# Altium project LPCB223__RLOOP__POWER_NODE.PrjPCB
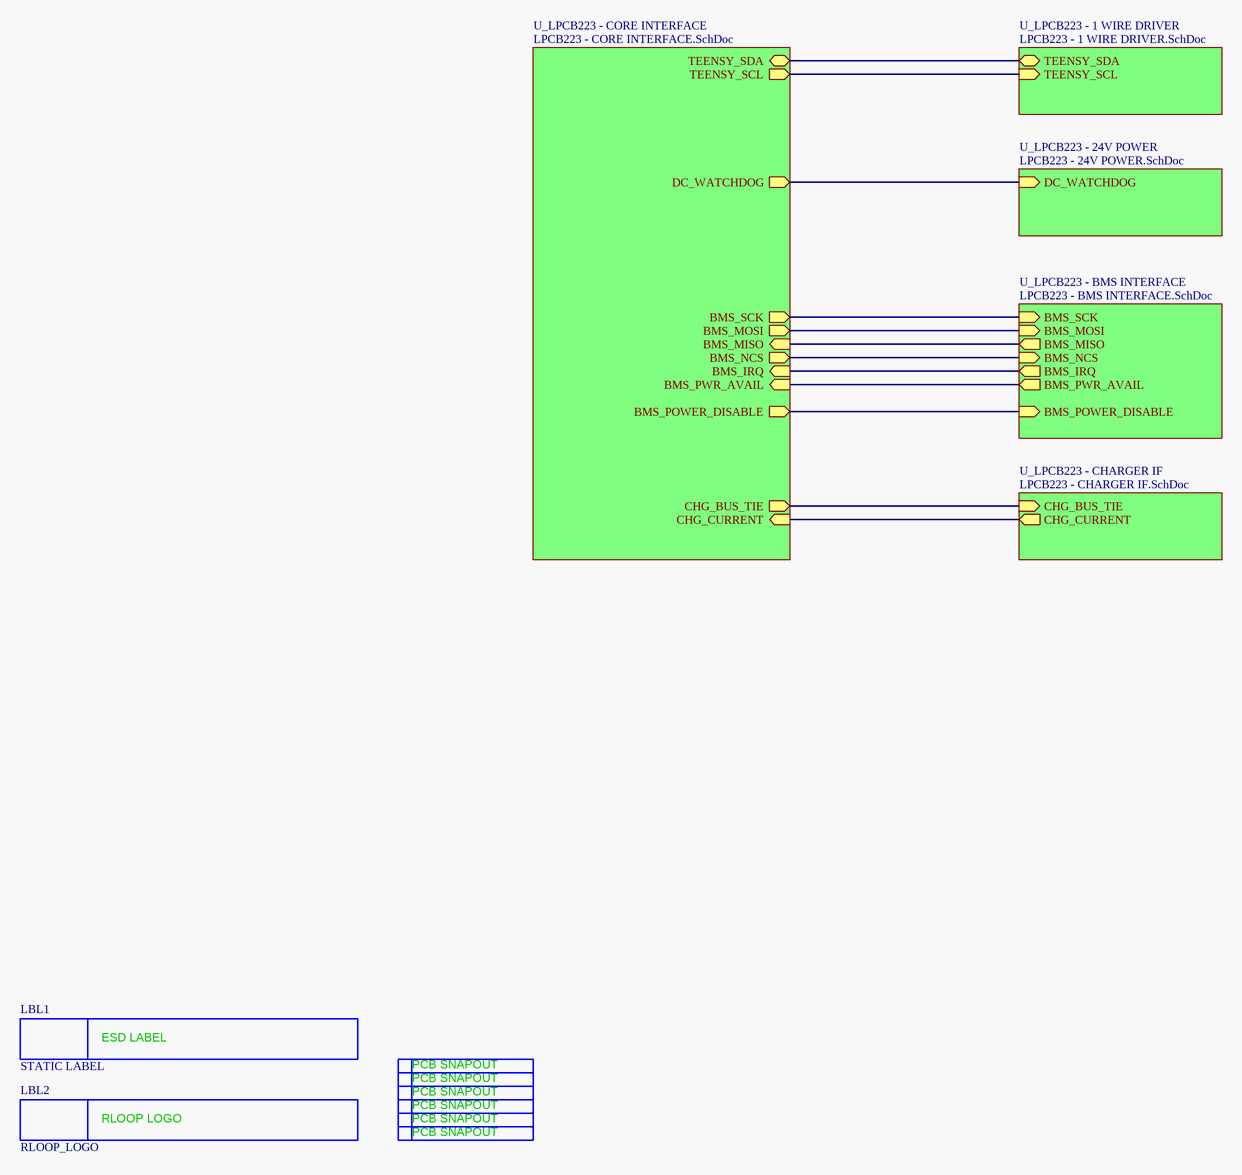
[diagram p0: LPCB223 - OVERVIEW.SchDoc]
6 sheets, 52 parts. Net scope: hierarchical (ports join the sheet entries above them; power ports are global).
Board files: LPCB223R0.PcbDoc, LPCB223R0__ASCII.PcbDoc
Sheets:
  LPCB223 - OVERVIEW.SchDoc
    U_LPCB223 - CORE INTERFACE = LPCB223 - CORE INTERFACE.SchDoc
    U_LPCB223 - 1 WIRE DRIVER = LPCB223 - 1 WIRE DRIVER.SchDoc
    U_LPCB223 - 24V POWER = LPCB223 - 24V POWER.SchDoc
    U_LPCB223 - BMS INTERFACE = LPCB223 - BMS INTERFACE.SchDoc
    U_LPCB223 - CHARGER IF = LPCB223 - CHARGER IF.SchDoc

## Sheet LPCB223 - OVERVIEW.SchDoc
size A3; Address1: Factory 10; Address2: 9-13 Dingley Avenue, Dandeong, VICTORIA 3175, AUSTRALIA; DocumentNumber: 1; Revision: 1; SheetNumber: 1; SheetTotal: 6; Lockie__PCB_SUB_ASSEMBLY: Overview; Lockie__PCB_ASSEMBLY: Main; Lockie__LDL: LPCB223; Lockie__PCB_DESCRIPTION: Power Node

### Parts
LBL1  STATIC LABEL  [STATIC_LABEL]  (no BOM)
LBL2  RLOOP_LOGO  [RLOOP_LOGO]  (no BOM)
SN1  PCB_SNAPOUT  [SNAPOUT_NEW]  (value not drawn)  (no BOM)
SN2  PCB_SNAPOUT  [SNAPOUT_NEW]  (value not drawn)  (no BOM)
SN3  PCB_SNAPOUT  [SNAPOUT_NEW]  (value not drawn)  (no BOM)
SN4  PCB_SNAPOUT  [SNAPOUT_NEW]  (value not drawn)  (no BOM)
SN5  PCB_SNAPOUT  [SNAPOUT_NEW]  (value not drawn)  (no BOM)
SN6  PCB_SNAPOUT  [SNAPOUT_NEW]  (value not drawn)  (no BOM)

### Sub-sheets
U_LPCB223 - 1 WIRE DRIVER = LPCB223 - 1 WIRE DRIVER.SchDoc: TEENSY_SDA (bidir), TEENSY_SCL (in)
U_LPCB223 - 24V POWER = LPCB223 - 24V POWER.SchDoc: DC_WATCHDOG (in)
U_LPCB223 - BMS INTERFACE = LPCB223 - BMS INTERFACE.SchDoc: BMS_MOSI (in), BMS_SCK (in), BMS_MISO (out), BMS_PWR_AVAIL (out), BMS_NCS (in), BMS_IRQ (out), BMS_POWER_DISABLE (in)
U_LPCB223 - CHARGER IF = LPCB223 - CHARGER IF.SchDoc: CHG_BUS_TIE (in), CHG_CURRENT (out)
U_LPCB223 - CORE INTERFACE = LPCB223 - CORE INTERFACE.SchDoc: BMS_MOSI (out), BMS_SCK (out), BMS_MISO (in), BMS_PWR_AVAIL (in), BMS_NCS (out), BMS_IRQ (in), DC_WATCHDOG (out), CHG_CURRENT (in), TEENSY_SDA (bidir), TEENSY_SCL (out), BMS_POWER_DISABLE (out), CHG_BUS_TIE (out)

### Nets
NetC8_1: sheet U_LPCB223 - CORE INTERFACE/CHG_CURRENT, sheet U_LPCB223 - CHARGER IF/CHG_CURRENT
NetCN1_2: sheet U_LPCB223 - CORE INTERFACE/DC_WATCHDOG, sheet U_LPCB223 - 24V POWER/DC_WATCHDOG
NetCN2_13: sheet U_LPCB223 - CORE INTERFACE/BMS_POWER_DISABLE, sheet U_LPCB223 - BMS INTERFACE/BMS_POWER_DISABLE
NetCN7_SCL: sheet U_LPCB223 - CORE INTERFACE/TEENSY_SCL, sheet U_LPCB223 - 1 WIRE DRIVER/TEENSY_SCL
NetCN7_SDA: sheet U_LPCB223 - CORE INTERFACE/TEENSY_SDA, sheet U_LPCB223 - 1 WIRE DRIVER/TEENSY_SDA
NetCN7_T10: sheet U_LPCB223 - CORE INTERFACE/BMS_NCS, sheet U_LPCB223 - BMS INTERFACE/BMS_NCS
NetCN7_T11: sheet U_LPCB223 - CORE INTERFACE/BMS_MOSI, sheet U_LPCB223 - BMS INTERFACE/BMS_MOSI
NetCN7_T12: sheet U_LPCB223 - CORE INTERFACE/BMS_MISO, sheet U_LPCB223 - BMS INTERFACE/BMS_MISO
NetCN7_T13: sheet U_LPCB223 - CORE INTERFACE/BMS_SCK, sheet U_LPCB223 - BMS INTERFACE/BMS_SCK
NetCN7_T15: sheet U_LPCB223 - CORE INTERFACE/CHG_BUS_TIE, sheet U_LPCB223 - CHARGER IF/CHG_BUS_TIE
NetCN7_T32: sheet U_LPCB223 - CORE INTERFACE/BMS_PWR_AVAIL, sheet U_LPCB223 - BMS INTERFACE/BMS_PWR_AVAIL
NetCN7_T33: sheet U_LPCB223 - CORE INTERFACE/BMS_IRQ, sheet U_LPCB223 - BMS INTERFACE/BMS_IRQ

### Notes on the sheet
- PCB COMPONENT DESCRIPTION
- LDL NUMBER
- Assembly Details
- Size
- Drawing File Name
- Revision
- http://rloop.org
- Scale
- A3
- Sheet Details
- N.T.S
- Sheet:
- Of:
- (in symbol PCB_SNAPOUT) PCB SNAPOUT
- (in symbol RLOOP_LOGO) RLOOP LOGO
- (in symbol STATIC LABEL) ESD LABEL

### Library data of the parts
LBL1 = STATIC LABEL: FMEDA__CHANNEL: DIAG; FMEDA__FUNCTION_IN_SYSTEM: *
LBL2 = RLOOP_LOGO: FMEDA__CHANNEL: DIAG; FMEDA__FUNCTION_IN_SYSTEM: *
SN1-SN6 = PCB_SNAPOUT: FMEDA__CHANNEL: DIAG; FMEDA__FUNCTION_IN_SYSTEM: *

## Sheet LPCB223 - CORE INTERFACE.SchDoc
size A3; Address1: Factory 10; Address2: 9-13 Dingley Avenue, Dandeong, VICTORIA 3175, AUSTRALIA; DocumentNumber: 6; Revision: 1; SheetNumber: 6; SheetTotal: 6; Lockie__PCB_SUB_ASSEMBLY: Core Interface; Lockie__PCB_ASSEMBLY: Main; Lockie__LDL: LPCB223; Lockie__PCB_DESCRIPTION: Power Node
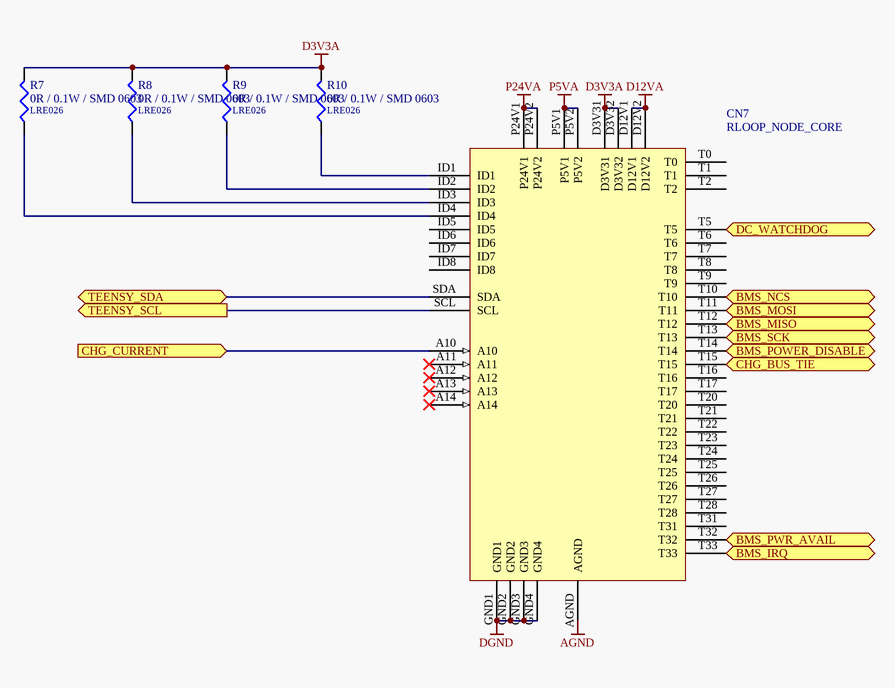
[diagram p1: LPCB223 - CORE INTERFACE.SchDoc]

### Parts
CN7  RLOOP_NODE_CORE  [RLOOP_NODE_CORE]  (no BOM)
R7  0R / 0.1W / SMD 0603  LDL_NUMBER: LRE026  [LFP020__CR1608-0603-IPC7351_B]
R8  0R / 0.1W / SMD 0603  LDL_NUMBER: LRE026  [LFP020__CR1608-0603-IPC7351_B]
R9  0R / 0.1W / SMD 0603  LDL_NUMBER: LRE026  [LFP020__CR1608-0603-IPC7351_B]
R10  0R / 0.1W / SMD 0603  LDL_NUMBER: LRE026  [LFP020__CR1608-0603-IPC7351_B]

### Ports
BMS_IRQ (in), BMS_MISO (in), BMS_MOSI (out), BMS_NCS (out), BMS_POWER_DISABLE (out), BMS_PWR_AVAIL (in), BMS_SCK (out), CHG_BUS_TIE (out), CHG_CURRENT (in), DC_WATCHDOG (out), TEENSY_SCL (out), TEENSY_SDA (bidir)

### Nets
AGND: CN7.AGND
D3V3A: CN7.D3V31 CN7.D3V32 R7.2 R8.2 R9.2 R10.2
D12VA: CN7.D12V1 CN7.D12V2
DGND: CN7.GND1 CN7.GND2 CN7.GND3 CN7.GND4
P5VA: CN7.P5V1 CN7.P5V2
P24VA: CN7.P24V1 CN7.P24V2
NetC8_1: CN7.A10 ; port CHG_CURRENT
NetCN1_2: CN7.T5 ; port DC_WATCHDOG
NetCN2_13: CN7.T14 ; port BMS_POWER_DISABLE
NetCN7_ID1: CN7.ID1 R10.1
NetCN7_ID2: CN7.ID2 R9.1
NetCN7_ID3: CN7.ID3 R8.1
NetCN7_ID4: CN7.ID4 R7.1
NetCN7_SCL: CN7.SCL ; port TEENSY_SCL
NetCN7_SDA: CN7.SDA ; port TEENSY_SDA
NetCN7_T10: CN7.T10 ; port BMS_NCS
NetCN7_T11: CN7.T11 ; port BMS_MOSI
NetCN7_T12: CN7.T12 ; port BMS_MISO
NetCN7_T13: CN7.T13 ; port BMS_SCK
NetCN7_T15: CN7.T15 ; port CHG_BUS_TIE
NetCN7_T32: CN7.T32 ; port BMS_PWR_AVAIL
NetCN7_T33: CN7.T33 ; port BMS_IRQ

Not connected (* = marked no-connect by the designer): CN7 A11* A12* A13* A14* ID5 ID6 ID7 ID8 T0 T1 T2 T6 T7 T8 T9 T16 T17 T20 T21 T22 T23 T24 T25 T26 T27 T28 T31

### Notes on the sheet
- PCB COMPONENT DESCRIPTION
- LDL NUMBER
- Assembly Details
- Size
- Drawing File Name
- Revision
- http://rloop.org
- Scale
- A3
- Sheet Details
- N.T.S
- Sheet:
- Of:

### Library data of the parts
CN7 = RLOOP_NODE_CORE: rLoop Node Core Connector; FMEDA__CHANNEL: COM; FMEDA__OPERATING__CURRENT_MAX: 0; FMEDA__OPERATING__TEMP_MAX: 50; FMEDA__OPERATING__TEMP_MIN: -20; FMEDA__OPERATING__TEMP_TYP: 27; FMEDA__OPERATING__VOLTAGE_MAX: 16; FMEDA__OPERATING__VOLTAGE_TYP: 12; FMEDA__OPERATING__CURRENT_MIN: 0; FMEDA__OPERATING__CURRENT_TYP: 0; FMEDA__OPERATING__VOLTAGE_MIN: 0
R7-R10 = 0R / 0.1W / SMD 0603: Resistor, Ceramic Chip, 0R, 0.1W, SMD 0603 [LRE026]; Value: 0; FMEDA__OPERATING__TEMP_MAX: 50; FMEDA__OPERATING__TEMP_MIN: -20; FMEDA__OPERATING__TEMP_TYP: 27; FMEDA__CHANNEL: COM; FMEDA__OPERATING__POWER_MAX: 0; FMEDA__OPERATING__POWER_MIN: 0; FMEDA__OPERATING__VOLTAGE_MAX: 0; FMEDA__OPERATING__VOLTAGE_MIN: 0; FMEDA__OPERATING__VOLTAGE_TYP: 0; FMEDA__FUNCTION_IN_SYSTEM: *

## Sheet LPCB223 - 1 WIRE DRIVER.SchDoc
size A3; Address1: Factory 10; Address2: 9-13 Dingley Avenue, Dandeong, VICTORIA 3175, AUSTRALIA; DocumentNumber: 2; Revision: 1; SheetNumber: 2; SheetTotal: 6; Lockie__PCB_SUB_ASSEMBLY: 1 Wire; Lockie__PCB_ASSEMBLY: Main; Lockie__LDL: LPCB223; Lockie__PCB_DESCRIPTION: Power Node
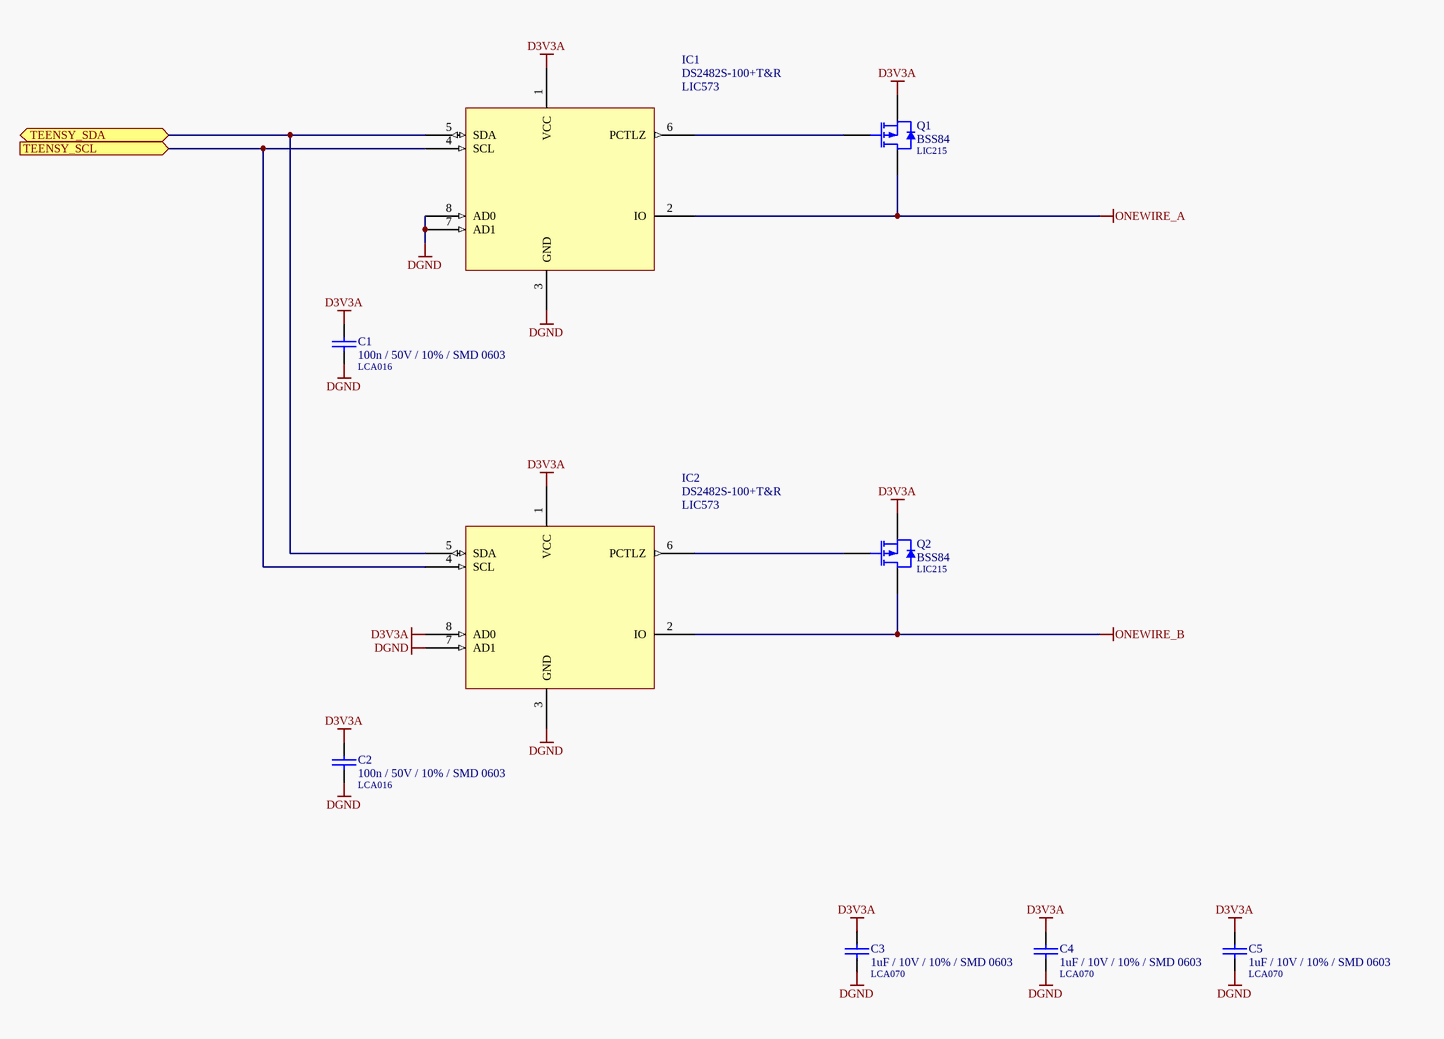
[diagram p2: LPCB223 - 1 WIRE DRIVER.SchDoc]

### Parts
C1  100n / 50V / 10% / SMD 0603  LDL_NUMBER: LCA016  [LFP011__CC1608-0603-IPC7351_B]
C2  100n / 50V / 10% / SMD 0603  LDL_NUMBER: LCA016  [LFP011__CC1608-0603-IPC7351_B]
C3  1uF / 10V / 10% / SMD 0603  LDL_NUMBER: LCA070  [LFP011__CC1608-0603-IPC7351_B]
C4  1uF / 10V / 10% / SMD 0603  LDL_NUMBER: LCA070  [LFP011__CC1608-0603-IPC7351_B]
C5  1uF / 10V / 10% / SMD 0603  LDL_NUMBER: LCA070  [LFP011__CC1608-0603-IPC7351_B]
IC1  DS2482S-100+T&R  LDL_NUMBER: LIC573  [LFP069__R-8G]
IC2  DS2482S-100+T&R  LDL_NUMBER: LIC573  [LFP069__R-8G]
Q1  BSS84  LDL_NUMBER: LIC215  [LFP021__SOT23]
Q2  BSS84  LDL_NUMBER: LIC215  [LFP021__SOT23]

### Ports
TEENSY_SCL (in), TEENSY_SDA (bidir)

### Nets
D3V3A: C1.1 C2.1 C3.1 C4.1 C5.1 IC1.1(VCC) IC2.1(VCC) IC2.8(AD0) Q1.2(S) Q2.2(S)
DGND: C1.2 C2.2 C3.2 C4.2 C5.2 IC1.3(GND) IC1.7(AD1) IC1.8(AD0) IC2.3(GND) IC2.7(AD1)
ONEWIRE_A: IC1.2(IO) Q1.3(D)
ONEWIRE_B: IC2.2(IO) Q2.3(D)
NetCN7_SCL: IC1.4(SCL) IC2.4(SCL) ; port TEENSY_SCL
NetCN7_SDA: IC1.5(SDA) IC2.5(SDA) ; port TEENSY_SDA
NetIC1_6: IC1.6(PCTLZ) Q1.1(G)
NetIC2_6: IC2.6(PCTLZ) Q2.1(G)

### Notes on the sheet
- PCB COMPONENT DESCRIPTION
- LDL NUMBER
- Assembly Details
- Size
- Drawing File Name
- Revision
- http://rloop.org
- Scale
- A3
- Sheet Details
- N.T.S
- Sheet:
- Of:

### Library data of the parts
C1 C2 = 100n / 50V / 10% / SMD 0603: Capacitor, Ceramic Chip, 100nF (0.1uF), 50V, 5%, SMD 0603 [LCA016]; FMEDA__OPERATING__VOLTAGE_MIN: 0; FMEDA__OPERATING__VOLTAGE_MAX: 3.3; FMEDA__OPERATING__TEMP_MIN: -20; FMEDA__OPERATING__TEMP_TYP: 27; FMEDA__OPERATING__TEMP_MAX: 50; FMEDA__CHANNEL: COM; Value: 100n; FMEDA__FUNCTION_IN_SYSTEM: *; FMEDA__OPERATING__VOLTAGE_TYP: 3.3
C3-C5 = 1uF / 10V / 10% / SMD 0603: Capacitor, Ceramic Chip, 1uF, 10V, SMD 0603 [LCA070]; Value: 1u; FMEDA__OPERATING__VOLTAGE_MAX: 3.3; FMEDA__OPERATING__VOLTAGE_MIN: 0; FMEDA__OPERATING__TEMP_MAX: 50; FMEDA__OPERATING__TEMP_MIN: -20; FMEDA__OPERATING__TEMP_TYP: 27; FMEDA__CHANNEL: COM; FMEDA__OPERATING__VOLTAGE_TYP: 3.3; FMEDA__FUNCTION_IN_SYSTEM: *
IC1 IC2 = DS2482S-100+T&R: IC, I2C to 1 Wire Bridge, SMD SOIC8
Q1 Q2 = BSS84: FET, P Channel, Logic Level, SMD SOT23 [LIC215]; FMEDA__OPERATING__TEMP_MAX: 50; FMEDA__OPERATING__TEMP_MIN: -20; FMEDA__OPERATING__TEMP_TYP: 27; FMEDA__CHANNEL: COM

## Sheet LPCB223 - 24V POWER.SchDoc
size A3; Address1: Factory 10; Address2: 9-13 Dingley Avenue, Dandeong, VICTORIA 3175, AUSTRALIA; DocumentNumber: 3; Revision: 1; SheetNumber: 3; SheetTotal: 6; Lockie__PCB_SUB_ASSEMBLY: 24V Switch; Lockie__PCB_ASSEMBLY: Main; Lockie__LDL: LPCB223; Lockie__PCB_DESCRIPTION: Power Node
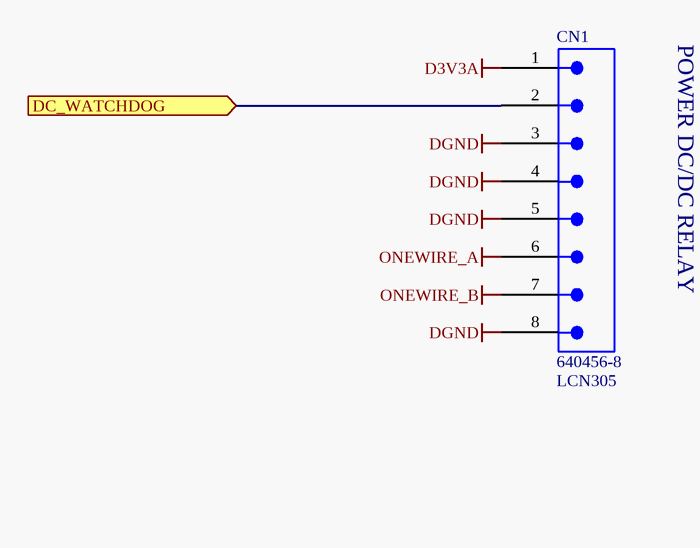
[diagram p3: LPCB223 - 24V POWER.SchDoc]

### Parts
CN1  640456-8  LDL_NUMBER: LCN305  [640456-8]

### Ports
DC_WATCHDOG (in)

### Nets
D3V3A: CN1.1
DGND: CN1.3 CN1.4 CN1.5 CN1.8
ONEWIRE_A: CN1.6
ONEWIRE_B: CN1.7
NetCN1_2: CN1.2 ; port DC_WATCHDOG

### Notes on the sheet
- POWER DC/DC RELAY
- PCB COMPONENT DESCRIPTION
- LDL NUMBER
- Assembly Details
- Size
- Drawing File Name
- Revision
- http://rloop.org
- Scale
- A3
- Sheet Details
- N.T.S
- Sheet:
- Of:

### Library data of the parts
CN1 = 640456-8: Connector, Male Header, 8 Way; FMEDA__CHANNEL: COM; FMEDA__OPERATING__CURRENT_MAX: 0; FMEDA__OPERATING__TEMP_MAX: 50; FMEDA__OPERATING__TEMP_MIN: -20; FMEDA__OPERATING__TEMP_TYP: 27; FMEDA__OPERATING__VOLTAGE_MAX: 16; FMEDA__OPERATING__VOLTAGE_TYP: 12; FMEDA__FUNCTION_IN_SYSTEM: *; FMEDA__OPERATING__CURRENT_MIN: 0; FMEDA__OPERATING__CURRENT_TYP: 0; FMEDA__OPERATING__VOLTAGE_MIN: 0

## Sheet LPCB223 - BMS INTERFACE.SchDoc
size A3; Address1: Factory 10; Address2: 9-13 Dingley Avenue, Dandeong, VICTORIA 3175, AUSTRALIA; DocumentNumber: 4; Revision: 1; SheetNumber: 4; SheetTotal: 6; Lockie__PCB_SUB_ASSEMBLY: BMS Interface; Lockie__PCB_ASSEMBLY: Main; Lockie__LDL: LPCB223; Lockie__PCB_DESCRIPTION: Power Node
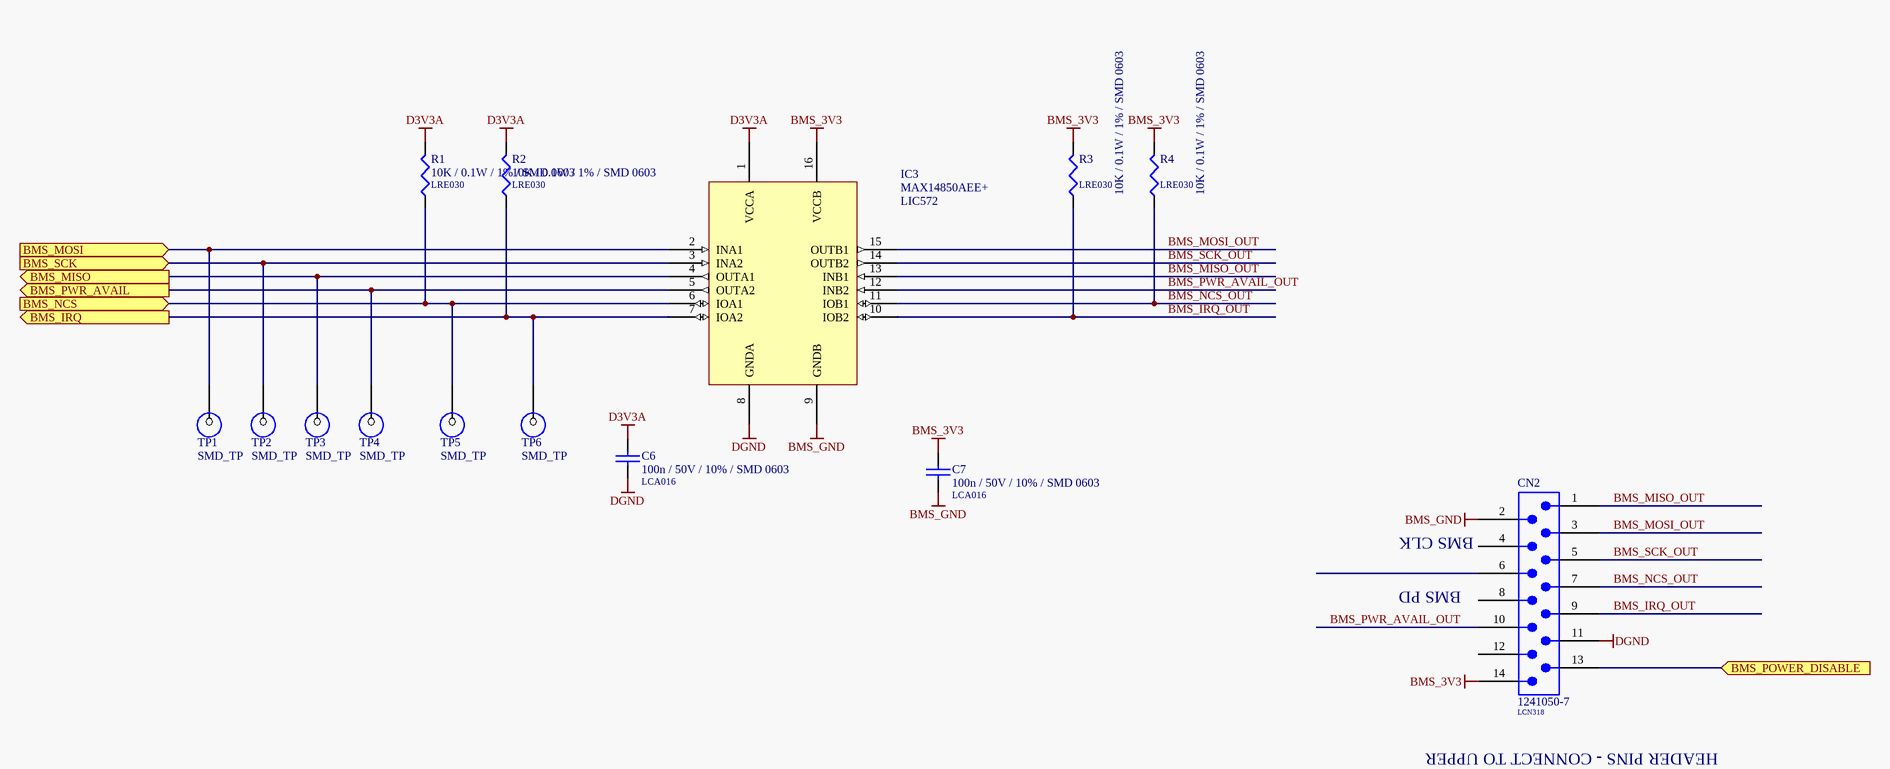
[diagram p4: LPCB223 - BMS INTERFACE.SchDoc]

### Parts
C6  100n / 50V / 10% / SMD 0603  LDL_NUMBER: LCA016  [LFP011__CC1608-0603-IPC7351_B]
C7  100n / 50V / 10% / SMD 0603  LDL_NUMBER: LCA016  [LFP011__CC1608-0603-IPC7351_B]
CN2  1241050-7  LDL_NUMBER: LCN318  [1241050-7]
IC3  MAX14850AEE+  LDL_NUMBER: LIC572  [LFP137__PW016]
R1  10K / 0.1W / 1% / SMD 0603  LDL_NUMBER: LRE030  [LFP020__CR1608-0603-IPC7351_B]
R2  10K / 0.1W / 1% / SMD 0603  LDL_NUMBER: LRE030  [LFP020__CR1608-0603-IPC7351_B]
R3  10K / 0.1W / 1% / SMD 0603  LDL_NUMBER: LRE030  [LFP020__CR1608-0603-IPC7351_B]
R4  10K / 0.1W / 1% / SMD 0603  LDL_NUMBER: LRE030  [LFP020__CR1608-0603-IPC7351_B]
TP1  SMD_TP  [SMD-TP]  (no BOM)
TP2  SMD_TP  [SMD-TP]  (no BOM)
TP3  SMD_TP  [SMD-TP]  (no BOM)
TP4  SMD_TP  [SMD-TP]  (no BOM)
TP5  SMD_TP  [SMD-TP]  (no BOM)
TP6  SMD_TP  [SMD-TP]  (no BOM)

### Ports
BMS_IRQ (out), BMS_MISO (out), BMS_MOSI (in), BMS_NCS (in), BMS_POWER_DISABLE (in), BMS_PWR_AVAIL (out), BMS_SCK (in)

### Nets
BMS_3V3: C7.1 CN2.14 IC3.16(VCCB) R3.2 R4.2
BMS_GND: C7.2 CN2.2 IC3.9(GNDB)
D3V3A: C6.1 IC3.1(VCCA) R1.2 R2.2
DGND: C6.2 CN2.11 IC3.8(GNDA)
BMS_IRQ_OUT: CN2.9 IC3.10(IOB2) R3.1
BMS_MISO_OUT: CN2.1 IC3.13(INB1)
BMS_MOSI_OUT: CN2.3 IC3.15(OUTB1)
BMS_NCS_OUT: CN2.7 IC3.11(IOB1) R4.1
BMS_PWR_AVAIL_OUT: CN2.10 IC3.12(INB2)
BMS_SCK_OUT: CN2.5 IC3.14(OUTB2)
NetCN2_13: CN2.13 ; port BMS_POWER_DISABLE
NetCN7_T10: IC3.6(IOA1) R1.1 TP5.1 ; port BMS_NCS
NetCN7_T11: IC3.2(INA1) TP1.1 ; port BMS_MOSI
NetCN7_T12: IC3.4(OUTA1) TP3.1 ; port BMS_MISO
NetCN7_T13: IC3.3(INA2) TP2.1 ; port BMS_SCK
NetCN7_T32: IC3.5(OUTA2) TP4.1 ; port BMS_PWR_AVAIL
NetCN7_T33: IC3.7(IOA2) R2.1 TP6.1 ; port BMS_IRQ

Not connected (* = marked no-connect by the designer): CN2 4 6 8 12

### Notes on the sheet
- BMS CLK
- BMS PD
- HEADER PINS - CONNECT TO UPPER
- PCB COMPONENT DESCRIPTION
- LDL NUMBER
- Assembly Details
- Size
- Drawing File Name
- Revision
- http://rloop.org
- Scale
- A3
- Sheet Details
- N.T.S
- Sheet:
- Of:

### Library data of the parts
C6 C7 = 100n / 50V / 10% / SMD 0603: as C1 on sheet LPCB223 - 1 WIRE DRIVER; Value: 100n; FMEDA__FUNCTION_IN_SYSTEM: *; FMEDA__OPERATING__VOLTAGE_TYP: 3.3
CN2 = 1241050-7: Connector, Header, 2.54mm, 7 Pins x 2 Rows, SMD; FMEDA__CHANNEL: COM; FMEDA__OPERATING__CURRENT_MAX: 0; FMEDA__OPERATING__TEMP_MAX: 50; FMEDA__OPERATING__TEMP_MIN: -20; FMEDA__OPERATING__TEMP_TYP: 27; FMEDA__OPERATING__VOLTAGE_MAX: 16; FMEDA__OPERATING__VOLTAGE_TYP: 12; FMEDA__FUNCTION_IN_SYSTEM: *; FMEDA__OPERATING__CURRENT_MIN: 0; FMEDA__OPERATING__CURRENT_TYP: 0; FMEDA__OPERATING__VOLTAGE_MIN: 0
IC3 = MAX14850AEE+: IC, 6 Channel Digital Isolator, SMD [LIC572]
R1-R4 = 10K / 0.1W / 1% / SMD 0603: Resistor, Ceramic Chip, 10K, 0.1W, 1%, SMD 0603 [LRE030]; FMEDA__OPERATING__POWER_MAX: 0; FMEDA__OPERATING__TEMP_MAX: 50; FMEDA__OPERATING__TEMP_MIN: -20; FMEDA__OPERATING__TEMP_TYP: 27; FMEDA__CHANNEL: COM; Value: 10K; FMEDA__OPERATING__POWER_MIN: 0; FMEDA__OPERATING__VOLTAGE_MAX: 0; FMEDA__OPERATING__VOLTAGE_MIN: 0; FMEDA__OPERATING__VOLTAGE_TYP: 0; FMEDA__FUNCTION_IN_SYSTEM: *
TP1-TP6 = SMD_TP: SMD Test Point; FMEDA__CHANNEL: COM; FMEDA__OPERATING__CURRENT_MAX: 0; FMEDA__OPERATING__TEMP_MAX: 50; FMEDA__OPERATING__TEMP_MIN: -20; FMEDA__OPERATING__TEMP_TYP: 27; FMEDA__OPERATING__VOLTAGE_MAX: 16; FMEDA__OPERATING__VOLTAGE_TYP: 12; FMEDA__OPERATING__CURRENT_MIN: 0; FMEDA__OPERATING__CURRENT_TYP: 0; FMEDA__OPERATING__VOLTAGE_MIN: 0

## Sheet LPCB223 - CHARGER IF.SchDoc
size A3; Address1: Factory 10; Address2: 9-13 Dingley Avenue, Dandeong, VICTORIA 3175, AUSTRALIA; DocumentNumber: 5; Revision: 1; SheetNumber: 5; SheetTotal: 6; Lockie__PCB_SUB_ASSEMBLY: Charger Interface; Lockie__PCB_ASSEMBLY: Main; Lockie__LDL: LPCB223; Lockie__PCB_DESCRIPTION: Power Node
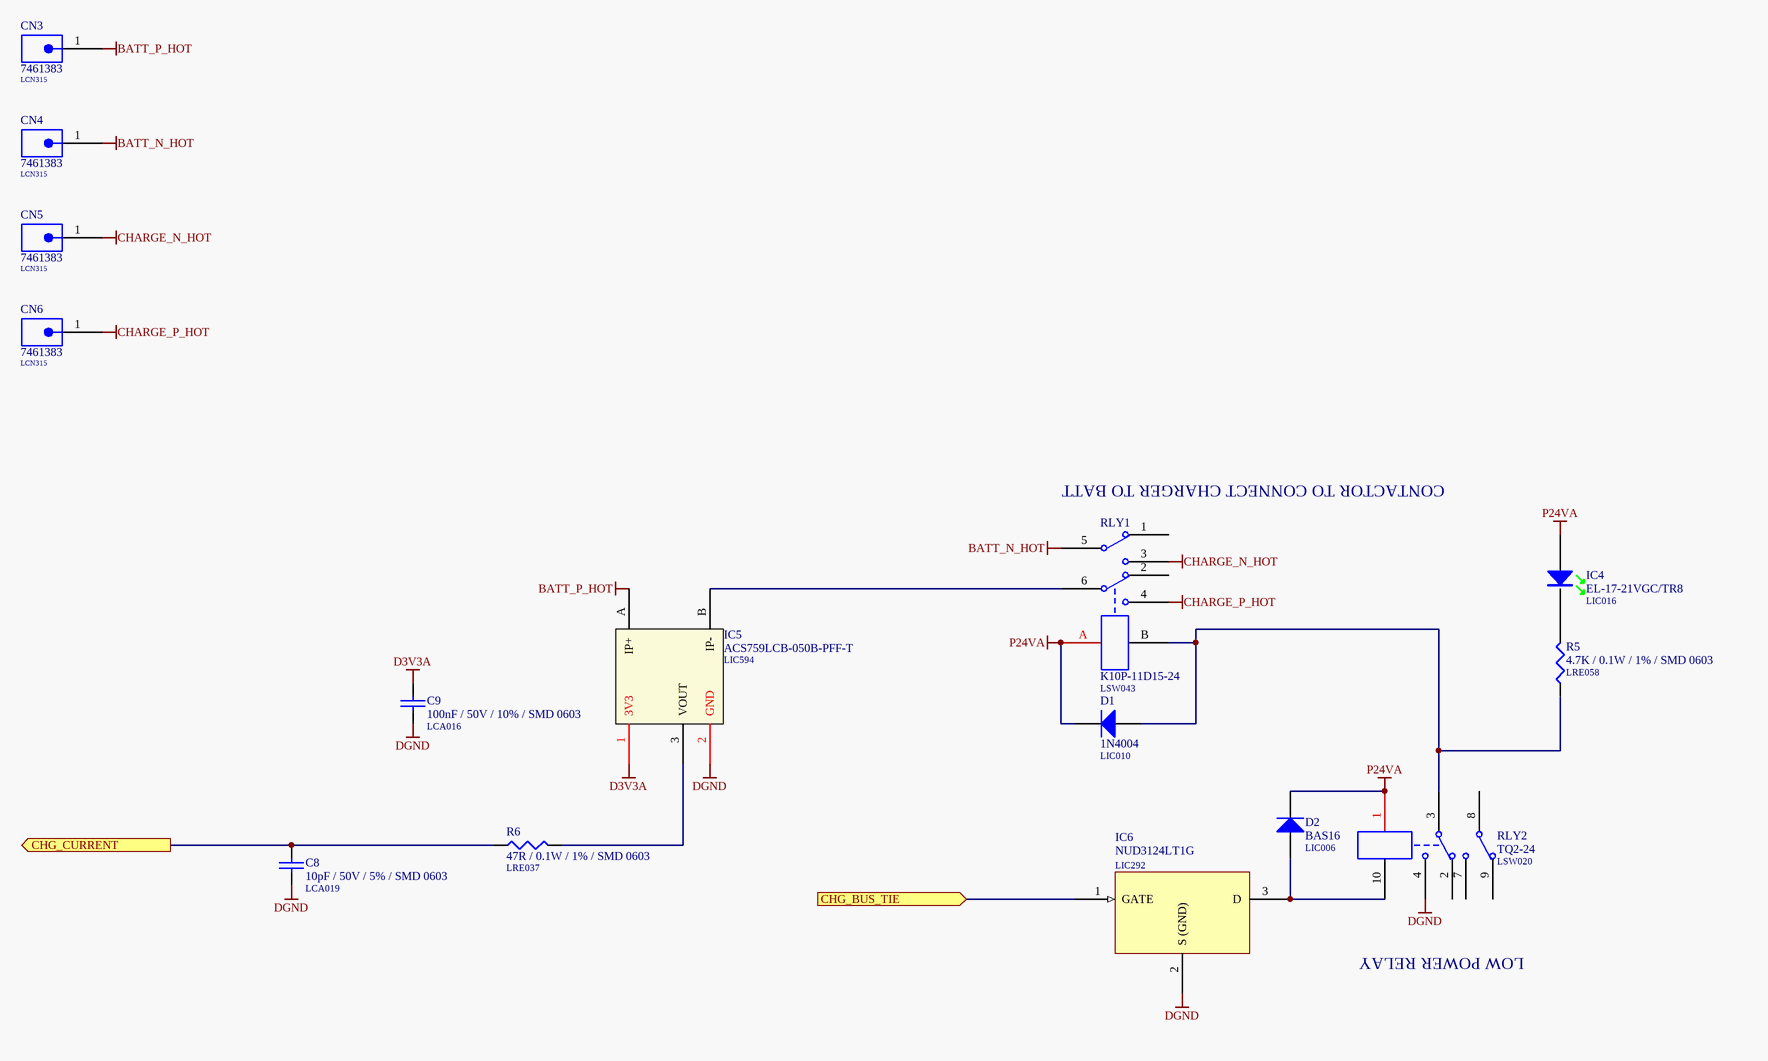
[diagram p5: LPCB223 - CHARGER IF.SchDoc]

### Parts
C8  10pF / 50V / 5% / SMD 0603  LDL_NUMBER: LCA019  [LFP011__CC1608-0603-IPC7351_B]
C9  100nF / 50V / 10% / SMD 0603  LDL_NUMBER: LCA016  [LFP011__CC1608-0603-IPC7351_B]
CN3  7461383  LDL_NUMBER: LCN315  [7461383]
CN4  7461383  LDL_NUMBER: LCN315  [7461383]
CN5  7461383  LDL_NUMBER: LCN315  [7461383]
CN6  7461383  LDL_NUMBER: LCN315  [7461383]
D1  1N4004  LDL_NUMBER: LIC010  [DO-41]
D2  BAS16  LDL_NUMBER: LIC006  [LFP021__SOT23]
IC4  EL-17-21VGC/TR8  LDL_NUMBER: LIC016  [CR2012-0805-LED]
IC5  ACS759LCB-050B-PFF-T  LDL_NUMBER: LIC594  [CB-PFF]
IC6  NUD3124LT1G  LDL_NUMBER: LIC292  [LFP021__SOT23]
R5  4.7K / 0.1W / 1% / SMD 0603  LDL_NUMBER: LRE058  [LFP020__CR1608-0603-IPC7351_B]
R6  47R / 0.1W / 1% / SMD 0603  LDL_NUMBER: LRE037  [LFP020__CR1608-0603-IPC7351_B]
RLY1  K10P-11D15-24  LDL_NUMBER: LSW043  [K10P-11D15-24]
RLY2  TQ2-24  LDL_NUMBER: LSW020  [TQ2]

### Ports
CHG_BUS_TIE (in), CHG_CURRENT (out)

### Nets
BATT_N_HOT: CN4.1 RLY1.5
BATT_P_HOT: CN3.1 IC5.A(IP+)
CHARGE_N_HOT: CN5.1 RLY1.3
CHARGE_P_HOT: CN6.1 RLY1.4
D3V3A: C9.1 IC5.1(3V3)
DGND: C8.2 C9.2 IC5.2(GND) IC6.2(S_(GND)) RLY2.4
P24VA: D1.K D2.3(K) IC4.A RLY1.A RLY2.1
NetC8_1: C8.1 R6.1 ; port CHG_CURRENT
NetCN7_T15: IC6.1(GATE) ; port CHG_BUS_TIE
NetD1_A: D1.A R5.1 RLY1.B RLY2.3
NetD2_1: D2.1(A) IC6.3(D) RLY2.10
NetIC4_K: IC4.K R5.2
NetIC5_3: IC5.3(VOUT) R6.2
NetIC5_B: IC5.B(IP-) RLY1.6

Not connected (* = marked no-connect by the designer): RLY1 1 2; RLY2 2 7 8 9

### Notes on the sheet
- (near RLY1) CONTACTOR TO CONNECT CHARGER TO BATT
- LOW POWER RELAY
- PCB COMPONENT DESCRIPTION
- LDL NUMBER
- Assembly Details
- Size
- Drawing File Name
- Revision
- http://rloop.org
- Scale
- A3
- Sheet Details
- N.T.S
- Sheet:
- Of:

### Library data of the parts
C8 = 10pF / 50V / 5% / SMD 0603: Capacitor, Ceramic Chip, 10pF, 50V, 5%, SMD 0603 [LCA019]; Value: 10p; FMEDA__OPERATING__VOLTAGE_MAX: 3.3; FMEDA__OPERATING__VOLTAGE_MIN: 0; FMEDA__OPERATING__TEMP_MAX: 50; FMEDA__OPERATING__TEMP_MIN: -20; FMEDA__OPERATING__TEMP_TYP: 27; FMEDA__CHANNEL: COM; FMEDA__OPERATING__VOLTAGE_TYP: 3.3; FMEDA__FUNCTION_IN_SYSTEM: *
C9 = 100nF / 50V / 10% / SMD 0603: Capacitor, Ceramic Chip, 100nF (0.1uF), 50V, 5%, SMD 0603 [LCA016]; Value: 100n; FMEDA__OPERATING__VOLTAGE_MIN: 0; FMEDA__OPERATING__VOLTAGE_MAX: 3.3; FMEDA__OPERATING__TEMP_MIN: -20; FMEDA__OPERATING__TEMP_TYP: 27; FMEDA__OPERATING__TEMP_MAX: 50; FMEDA__CHANNEL: COM; FMEDA__FUNCTION_IN_SYSTEM: *; FMEDA__OPERATING__VOLTAGE_TYP: 3.3
CN3-CN6 = 7461383: Terminal, Bush with M5 Shank; FMEDA__CHANNEL: COM; FMEDA__OPERATING__CURRENT_MAX: 0; FMEDA__OPERATING__TEMP_MAX: 50; FMEDA__OPERATING__TEMP_MIN: -20; FMEDA__OPERATING__TEMP_TYP: 27; FMEDA__OPERATING__VOLTAGE_MAX: 16; FMEDA__OPERATING__VOLTAGE_TYP: 12; FMEDA__OPERATING__CURRENT_MIN: 0; FMEDA__OPERATING__CURRENT_TYP: 0; FMEDA__OPERATING__VOLTAGE_MIN: 0
D1 = 1N4004: Diode, General Purpose Rectifier, 1A, PTH [LIC010]; FMEDA__OPERATING__TEMP_MAX: 50; FMEDA__OPERATING__TEMP_MIN: -20; FMEDA__OPERATING__TEMP_TYP: 27; FMEDA__OPERATING__VOLTAGE_MAX: 0; FMEDA__CHANNEL: COM; FMEDA__FUNCTION_IN_SYSTEM: *; FMEDA__OPERATING__VOLTAGE_MIN: 0; FMEDA__OPERATING__VOLTAGE_TYP: 0; FMEDA__OPERATING__CURRENT_MAX: 0; FMEDA__OPERATING__CURRENT_MIN: 0; FMEDA__OPERATING__CURRENT_TYP: 0
D2 = BAS16: Diode, Small Signal, 0.2A, 85V, SMD SOT-23 [LIC006]; FMEDA__OPERATING__CURRENT_MIN: 0; FMEDA__OPERATING__TEMP_MIN: -20; FMEDA__OPERATING__TEMP_TYP: 27; FMEDA__OPERATING__TEMP_MAX: 50; FMEDA__CHANNEL: COM; FMEDA__OPERATING__CURRENT_MAX: 0; FMEDA__OPERATING__VOLTAGE_MIN: 0; FMEDA__OPERATING__VOLTAGE_MAX: 0; FMEDA__FUNCTION_IN_SYSTEM: *; FMEDA__OPERATING__CURRENT_TYP: 0; FMEDA__OPERATING__VOLTAGE_TYP: 0
IC4 = EL-17-21VGC/TR8: LED, SMD, 0805 Green [LIC016]; FMEDA__OPERATING__TEMP_MAX: 50; FMEDA__OPERATING__TEMP_MIN: -20; FMEDA__OPERATING__TEMP_TYP: 27; FMEDA__CHANNEL: COM; FMEDA__FUNCTION_IN_SYSTEM: *
IC5 = ACS759LCB-050B-PFF-T: IC, Hall Effect Current Sensor, PTH; FMEDA__OPERATING__TEMP_MAX: 50; FMEDA__OPERATING__TEMP_MIN: -20; FMEDA__OPERATING__TEMP_TYP: 27; FMEDA__CHANNEL: COM; FMEDA__FUNCTION_IN_SYSTEM: *
IC6 = NUD3124LT1G: IC, Relay Driver, 28V Industrial, SMD SOT23 [LIC292]; FMEDA__OPERATING__TEMP_MIN: -20; FMEDA__OPERATING__TEMP_TYP: 27; FMEDA__OPERATING__TEMP_MAX: 50; FMEDA__OPERATING__VOLTAGE_MIN: 0; FMEDA__OPERATING__VOLTAGE_TYP: 13; FMEDA__OPERATING__VOLTAGE_MAX: 18; FMEDA__OPERATING__POWER_TYP: 0.1; FMEDA__OPERATING__POWER_MAX: 0.15; FMEDA__CHANNEL: COM; FMEDA__FUNCTION_IN_SYSTEM: *; FMEDA__OPERATING__POWER_MIN: 0
R5 = 4.7K / 0.1W / 1% / SMD 0603: Resistor, Ceramic Chip, 4K7, 0.1W, 1%, SMD 0603 [LRE058]; FMEDA__OPERATING__POWER_MAX: 0; FMEDA__OPERATING__TEMP_MAX: 50; FMEDA__OPERATING__TEMP_MIN: -20; FMEDA__OPERATING__TEMP_TYP: 27; FMEDA__CHANNEL: COM; VALUE: 4.7K; FMEDA__OPERATING__POWER_MIN: 0; FMEDA__OPERATING__VOLTAGE_MAX: 0; FMEDA__OPERATING__VOLTAGE_MIN: 0; FMEDA__OPERATING__VOLTAGE_TYP: 0; FMEDA__FUNCTION_IN_SYSTEM: *
R6 = 47R / 0.1W / 1% / SMD 0603: Resistor, Ceramic Chip, 47R, 0.1W, 1%, SMD 0603 [LRE037]; VALUE: 47; FMEDA__OPERATING__POWER_MAX: 0; FMEDA__OPERATING__TEMP_MAX: 50; FMEDA__OPERATING__TEMP_MIN: -20; FMEDA__OPERATING__TEMP_TYP: 27; FMEDA__CHANNEL: COM; FMEDA__OPERATING__POWER_MIN: 0; FMEDA__OPERATING__VOLTAGE_MAX: 0; FMEDA__OPERATING__VOLTAGE_MIN: 0; FMEDA__OPERATING__VOLTAGE_TYP: 0; FMEDA__FUNCTION_IN_SYSTEM: *
RLY1 = K10P-11D15-24: Relay, DPDT, 24V, Socket Mount; FMEDA__OPERATING__TEMP_MAX: 50; FMEDA__OPERATING__TEMP_MIN: -20; FMEDA__OPERATING__TEMP_TYP: 27; FMEDA__CHANNEL: COM; Revision: July-2002: Re-released for DXP Platform.; FMEDA__FUNCTION_IN_SYSTEM: *
RLY2 = TQ2-24: Relay, DPDT, Non Latching, 24VDC Coil, 1A Rating, PTH; FMEDA__CHANNEL: COM; FMEDA__OPERATING__TEMP_MAX: 50; FMEDA__OPERATING__TEMP_MIN: -20; FMEDA__OPERATING__TEMP_TYP: 27; Revision: July-2002: Re-released for DXP Platform.

## Nets that join several sheets
D3V3A: LPCB223 - CORE INTERFACE (6 pins), LPCB223 - 1 WIRE DRIVER (10 pins), LPCB223 - 24V POWER (CN1.1), LPCB223 - BMS INTERFACE (C6.1 IC3.1 R1.2 R2.2), LPCB223 - CHARGER IF (C9.1 IC5.1)
DGND: LPCB223 - CORE INTERFACE (CN7.GND1 CN7.GND2 CN7.GND3 CN7.GND4), LPCB223 - 1 WIRE DRIVER (10 pins), LPCB223 - 24V POWER (CN1.3 CN1.4 CN1.5 CN1.8), LPCB223 - BMS INTERFACE (C6.2 CN2.11 IC3.8), LPCB223 - CHARGER IF (5 pins)
ONEWIRE_A: LPCB223 - 1 WIRE DRIVER (IC1.2 Q1.3), LPCB223 - 24V POWER (CN1.6)
ONEWIRE_B: LPCB223 - 1 WIRE DRIVER (IC2.2 Q2.3), LPCB223 - 24V POWER (CN1.7)
P24VA: LPCB223 - CORE INTERFACE (CN7.P24V1 CN7.P24V2), LPCB223 - CHARGER IF (5 pins)
NetC8_1: LPCB223 - CORE INTERFACE (CN7.A10), LPCB223 - CHARGER IF (C8.1 R6.1)
NetCN1_2: LPCB223 - CORE INTERFACE (CN7.T5), LPCB223 - 24V POWER (CN1.2)
NetCN2_13: LPCB223 - CORE INTERFACE (CN7.T14), LPCB223 - BMS INTERFACE (CN2.13)
NetCN7_SCL: LPCB223 - CORE INTERFACE (CN7.SCL), LPCB223 - 1 WIRE DRIVER (IC1.4 IC2.4)
NetCN7_SDA: LPCB223 - CORE INTERFACE (CN7.SDA), LPCB223 - 1 WIRE DRIVER (IC1.5 IC2.5)
NetCN7_T10: LPCB223 - CORE INTERFACE (CN7.T10), LPCB223 - BMS INTERFACE (IC3.6 R1.1 TP5.1)
NetCN7_T11: LPCB223 - CORE INTERFACE (CN7.T11), LPCB223 - BMS INTERFACE (IC3.2 TP1.1)
NetCN7_T12: LPCB223 - CORE INTERFACE (CN7.T12), LPCB223 - BMS INTERFACE (IC3.4 TP3.1)
NetCN7_T13: LPCB223 - CORE INTERFACE (CN7.T13), LPCB223 - BMS INTERFACE (IC3.3 TP2.1)
NetCN7_T15: LPCB223 - CORE INTERFACE (CN7.T15), LPCB223 - CHARGER IF (IC6.1)
NetCN7_T32: LPCB223 - CORE INTERFACE (CN7.T32), LPCB223 - BMS INTERFACE (IC3.5 TP4.1)
NetCN7_T33: LPCB223 - CORE INTERFACE (CN7.T33), LPCB223 - BMS INTERFACE (IC3.7 R2.1 TP6.1)